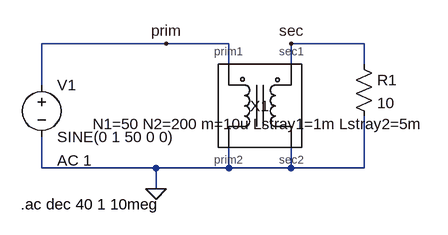
[diagram p0: schematic xformer_with_strays_test.asc]
xformer_with_strays_test.asc, the LTspice schematic file:
Version 4
SHEET 1 880 680
WIRE 64 48 -128 48
WIRE 160 48 64 48
WIRE 368 48 256 48
WIRE 160 80 160 48
WIRE 256 80 256 48
WIRE 368 80 368 48
WIRE -128 112 -128 48
WIRE -128 240 -128 192
WIRE 48 240 -128 240
WIRE 160 240 160 208
WIRE 160 240 48 240
WIRE 256 240 256 208
WIRE 256 240 160 240
WIRE 368 240 368 160
WIRE 368 240 256 240
WIRE 48 272 48 240
FLAG 48 272 0
FLAG 64 48 prim
FLAG 256 48 sec
SYMBOL voltage -128 96 R0
WINDOW 123 24 132 Left 0
WINDOW 39 0 0 Left 0
SYMATTR Value2 AC 1
SYMATTR InstName V1
SYMATTR Value SINE(0 1 50 0 0)
SYMBOL xformer_with_strays 208 144 R0
WINDOW 39 0 28 Center 0
SYMATTR SpiceLine N1=50 N2=200 m=10u Lstray1=1m Lstray2=5m
SYMATTR InstName X1
SYMBOL res 352 64 R0
SYMATTR InstName R1
SYMATTR Value 10
TEXT -160 296 Left 0 !.ac dec 40 1 10meg

The netlist it stands for:
* xformer_with_strays_test.asc
V1 prim 0 SINE(0 1 50 0 0) AC 1
XX1 prim 0 sec 0 xformer_with_strays N1=50 N2=200 m=10u Lstray1=1m Lstray2=5m  ; pins prim1 prim2 sec1 sec2
R1 sec 0 10
.ac dec 40 1 10meg
.backanno
.end